# Altium schematic sheet K7410tFFG900Aux.SchDoc
size A3
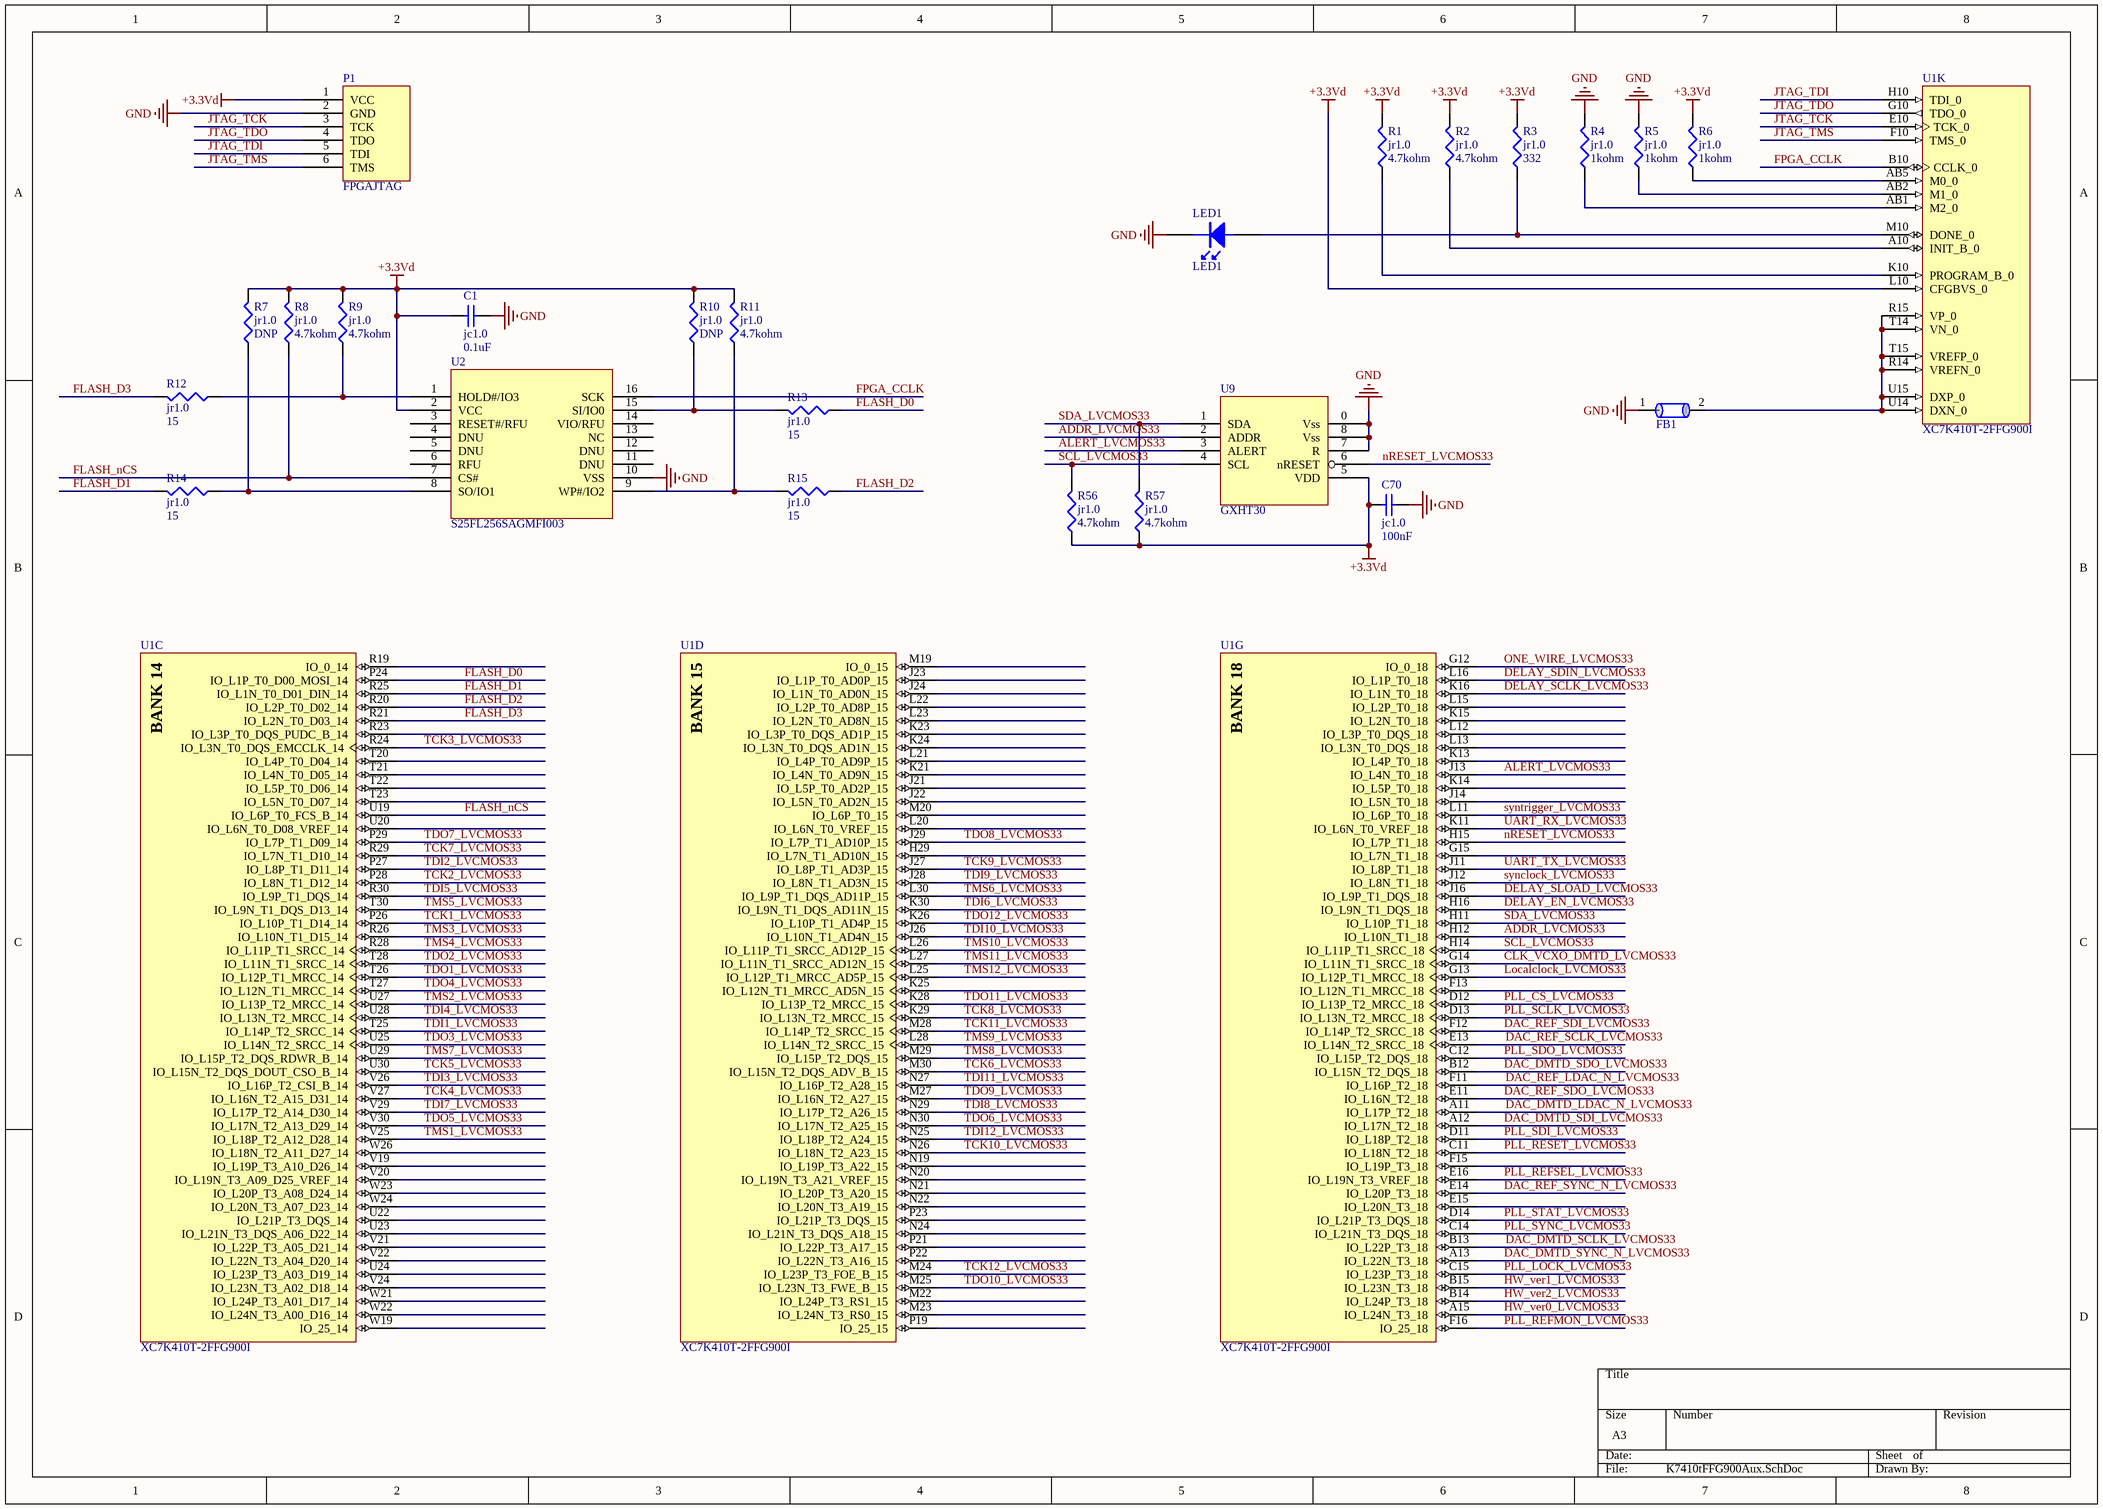
[diagram p0: K7410tFFG900Aux.SchDoc]

## Parts
C1  jc1.0  value 0.1uF  [0402]
C70  jc1.0  value 100nF  [0402]
FB1  Ferrite Bead  [0603]  (value not drawn)
LED1  LED1  [LED1]
P1  FPGAJTAG  [SIP6]
R1  jr1.0  value 4.7kohm  [0402]
R2  jr1.0  value 4.7kohm  [0402]
R3  jr1.0  value 332  [0402]
R4  jr1.0  value 1kohm  [0402]
R5  jr1.0  value 1kohm  [0402]
R6  jr1.0  value 1kohm  [0402]
R7  jr1.0  value DNP  [0402]
R8  jr1.0  value 4.7kohm  [0402]
R9  jr1.0  value 4.7kohm  [0402]
R10  jr1.0  value DNP  [0402]
R11  jr1.0  value 4.7kohm  [0402]
R12  jr1.0  value 15  [0402]
R13  jr1.0  value 15  [0402]
R14  jr1.0  value 15  [0402]
R15  jr1.0  value 15  [0402]
R56  jr1.0  value 4.7kohm  [0402]
R57  jr1.0  value 4.7kohm  [0402]
U1  XC7K410T-2FFG900I  [FFG900]  (parts C,D,G,K of 16)
U2  S25FL256SAGMFI003  [SO3016]
U9  GXHT30  [GXHT30]

## Nets
+3.3Vd: C1.2 C70.1 P1.1(VCC) R1.2 R2.2 R3.2 R6.2 R7.2 R8.2 R9.2 R10.2 R11.2 R56.1 R57.1 U1.L10(CFGBVS_0) U2.2(VCC) U9.5(VDD)
GND: C1.1 C70.2 FB1.1(X) LED1.2 P1.2(GND) R4.2 R5.2 U2.10(VSS) U9.0(Vss) U9.7(R) U9.8(Vss)
ADDR_LVCMOS33: U1.H12(IO_L10N_T1_18) U9.2(ADDR)
ALERT_LVCMOS33: U1.J13(IO_L4N_T0_18) U9.3(ALERT)
CLK_VCXO_DMTD_LVCMOS33: U1.G14(IO_L11N_T1_SRCC_18)
DAC_DMTD_LDAC_N_LVCMOS33: U1.A11(IO_L17P_T2_18)
DAC_DMTD_SCLK_LVCMOS33: U1.B13(IO_L22P_T3_18)
DAC_DMTD_SDI_LVCMOS33: U1.A12(IO_L17N_T2_18)
DAC_DMTD_SDO_LVCMOS33: U1.B12(IO_L15N_T2_DQS_18)
DAC_DMTD_SYNC_N_LVCMOS33: U1.A13(IO_L22N_T3_18)
DAC_REF_LDAC_N_LVCMOS33: U1.F11(IO_L16P_T2_18)
DAC_REF_SCLK_LVCMOS33: U1.E13(IO_L14N_T2_SRCC_18)
DAC_REF_SDI_LVCMOS33: U1.F12(IO_L14P_T2_SRCC_18)
DAC_REF_SDO_LVCMOS33: U1.E11(IO_L16N_T2_18)
DAC_REF_SYNC_N_LVCMOS33: U1.E14(IO_L20P_T3_18)
DELAY_EN_LVCMOS33: U1.H16(IO_L9N_T1_DQS_18)
DELAY_SCLK_LVCMOS33: U1.K16(IO_L1N_T0_18)
DELAY_SDIN_LVCMOS33: U1.L16(IO_L1P_T0_18)
DELAY_SLOAD_LVCMOS33: U1.J16(IO_L9P_T1_DQS_18)
FLASH_D0: R13.1 U1.P24(IO_L1P_T0_D00_MOSI_14)
FLASH_D1: R14.2 U1.R25(IO_L1N_T0_D01_DIN_14)
FLASH_D2: R15.1 U1.R20(IO_L2P_T0_D02_14)
FLASH_D3: R12.2 U1.R21(IO_L2N_T0_D03_14)
FLASH_nCS: R8.1 U1.U19(IO_L6P_T0_FCS_B_14) U2.7(CS#)
FPGA_CCLK: U1.B10(CCLK_0) U2.16(SCK)
HW_ver0_LVCMOS33: U1.A15(IO_L24N_T3_18)
HW_ver1_LVCMOS33: U1.B15(IO_L23N_T3_18)
HW_ver2_LVCMOS33: U1.B14(IO_L24P_T3_18)
JTAG_TCK: P1.3(TCK) U1.E10(TCK_0)
JTAG_TDI: P1.5(TDI) U1.H10(TDI_0)
JTAG_TDO: P1.4(TDO) U1.G10(TDO_0)
JTAG_TMS: P1.6(TMS) U1.F10(TMS_0)
Localclock_LVCMOS33: U1.G13(IO_L12P_T1_MRCC_18)
nRESET_LVCMOS33: U1.H15(IO_L7P_T1_18) U9.6(nRESET)
ONE_WIRE_LVCMOS33: U1.G12(IO_0_18)
PLL_CS_LVCMOS33: U1.D12(IO_L13P_T2_MRCC_18)
PLL_LOCK_LVCMOS33: U1.C15(IO_L23P_T3_18)
PLL_REFMON_LVCMOS33: U1.F16(IO_25_18)
PLL_REFSEL_LVCMOS33: U1.E16(IO_L19N_T3_VREF_18)
PLL_RESET_LVCMOS33: U1.C11(IO_L18N_T2_18)
PLL_SCLK_LVCMOS33: U1.D13(IO_L13N_T2_MRCC_18)
PLL_SDI_LVCMOS33: U1.D11(IO_L18P_T2_18)
PLL_SDO_LVCMOS33: U1.C12(IO_L15P_T2_DQS_18)
PLL_STAT_LVCMOS33: U1.D14(IO_L21P_T3_DQS_18)
PLL_SYNC_LVCMOS33: U1.C14(IO_L21N_T3_DQS_18)
SCL_LVCMOS33: R56.2 U1.H14(IO_L11P_T1_SRCC_18) U9.4(SCL)
SDA_LVCMOS33: R57.2 U1.H11(IO_L10P_T1_18) U9.1(SDA)
synclock_LVCMOS33: U1.J12(IO_L8N_T1_18)
syntrigger_LVCMOS33: U1.L11(IO_L6P_T0_18)
TCK1_LVCMOS33: U1.P26(IO_L10P_T1_D14_14)
TCK2_LVCMOS33: U1.P28(IO_L8N_T1_D12_14)
TCK3_LVCMOS33: U1.R24(IO_L3N_T0_DQS_EMCCLK_14)
TCK4_LVCMOS33: U1.V27(IO_L16N_T2_A15_D31_14)
TCK5_LVCMOS33: U1.U30(IO_L15N_T2_DQS_DOUT_CSO_B_14)
TCK6_LVCMOS33: U1.M30(IO_L15N_T2_DQS_ADV_B_15)
TCK7_LVCMOS33: U1.R29(IO_L7N_T1_D10_14)
TCK8_LVCMOS33: U1.K29(IO_L13N_T2_MRCC_15)
TCK9_LVCMOS33: U1.J27(IO_L8P_T1_AD3P_15)
TCK10_LVCMOS33: U1.N26(IO_L18N_T2_A23_15)
TCK11_LVCMOS33: U1.M28(IO_L14P_T2_SRCC_15)
TCK12_LVCMOS33: U1.M24(IO_L23P_T3_FOE_B_15)
TDI1_LVCMOS33: U1.T25(IO_L14P_T2_SRCC_14)
TDI2_LVCMOS33: U1.P27(IO_L8P_T1_D11_14)
TDI3_LVCMOS33: U1.V26(IO_L16P_T2_CSI_B_14)
TDI4_LVCMOS33: U1.U28(IO_L13N_T2_MRCC_14)
TDI5_LVCMOS33: U1.R30(IO_L9P_T1_DQS_14)
TDI6_LVCMOS33: U1.K30(IO_L9N_T1_DQS_AD11N_15)
TDI7_LVCMOS33: U1.V29(IO_L17P_T2_A14_D30_14)
TDI8_LVCMOS33: U1.N29(IO_L17P_T2_A26_15)
TDI9_LVCMOS33: U1.J28(IO_L8N_T1_AD3N_15)
TDI10_LVCMOS33: U1.J26(IO_L10N_T1_AD4N_15)
TDI11_LVCMOS33: U1.N27(IO_L16P_T2_A28_15)
TDI12_LVCMOS33: U1.N25(IO_L18P_T2_A24_15)
TDO1_LVCMOS33: U1.T26(IO_L12P_T1_MRCC_14)
TDO2_LVCMOS33: U1.T28(IO_L11N_T1_SRCC_14)
TDO3_LVCMOS33: U1.U25(IO_L14N_T2_SRCC_14)
TDO4_LVCMOS33: U1.T27(IO_L12N_T1_MRCC_14)
TDO5_LVCMOS33: U1.V30(IO_L17N_T2_A13_D29_14)
TDO6_LVCMOS33: U1.N30(IO_L17N_T2_A25_15)
TDO7_LVCMOS33: U1.P29(IO_L7P_T1_D09_14)
TDO8_LVCMOS33: U1.J29(IO_L7P_T1_AD10P_15)
TDO9_LVCMOS33: U1.M27(IO_L16N_T2_A27_15)
TDO10_LVCMOS33: U1.M25(IO_L23N_T3_FWE_B_15)
TDO11_LVCMOS33: U1.K28(IO_L13P_T2_MRCC_15)
TDO12_LVCMOS33: U1.K26(IO_L10P_T1_AD4P_15)
TMS1_LVCMOS33: U1.V25(IO_L18P_T2_A12_D28_14)
TMS2_LVCMOS33: U1.U27(IO_L13P_T2_MRCC_14)
TMS3_LVCMOS33: U1.R26(IO_L10N_T1_D15_14)
TMS4_LVCMOS33: U1.R28(IO_L11P_T1_SRCC_14)
TMS5_LVCMOS33: U1.T30(IO_L9N_T1_DQS_D13_14)
TMS6_LVCMOS33: U1.L30(IO_L9P_T1_DQS_AD11P_15)
TMS7_LVCMOS33: U1.U29(IO_L15P_T2_DQS_RDWR_B_14)
TMS8_LVCMOS33: U1.M29(IO_L15P_T2_DQS_15)
TMS9_LVCMOS33: U1.L28(IO_L14N_T2_SRCC_15)
TMS10_LVCMOS33: U1.L26(IO_L11P_T1_SRCC_AD12P_15)
TMS11_LVCMOS33: U1.L27(IO_L11N_T1_SRCC_AD12N_15)
TMS12_LVCMOS33: U1.L25(IO_L12P_T1_MRCC_AD5P_15)
UART_RX_LVCMOS33: U1.K11(IO_L6N_T0_VREF_18)
UART_TX_LVCMOS33: U1.J11(IO_L8P_T1_18)
NetFB1_2: FB1.2(Y) U1.R14(VREFN_0) U1.R15(VP_0) U1.T14(VN_0) U1.T15(VREFP_0) U1.U14(DXN_0) U1.U15(DXP_0)
NetLED1_1: LED1.1 R3.1 U1.M10(DONE_0)
NetR1_1: R1.1 U1.K10(PROGRAM_B_0)
NetR2_1: R2.1 U1.A10(INIT_B_0)
NetR4_1: R4.1 U1.AB1(M2_0)
NetR5_1: R5.1 U1.AB2(M1_0)
NetR6_1: R6.1 U1.AB5(M0_0)
NetR7_1: R7.1 R14.1 U2.8(SO/IO1)
NetR9_1: R9.1 R12.1 U2.1(HOLD#/IO3)
NetR10_1: R10.1 R13.2 U2.15(SI/IO0)
NetR11_1: R11.1 R15.2 U2.9(WP#/IO2)

Not connected (* = marked no-connect by the designer): U1 E15(IO_L20N_T3_18) F13(IO_L12N_T1_MRCC_18) F15(IO_L19P_T3_18) G15(IO_L7N_T1_18) H29(IO_L7N_T1_AD10N_15) J14(IO_L5N_T0_18) J21(IO_L5P_T0_AD2P_15) J22(IO_L5N_T0_AD2N_15) J23(IO_L1P_T0_AD0P_15) J24(IO_L1N_T0_AD0N_15) K13(IO_L4P_T0_18) K14(IO_L5P_T0_18) K15(IO_L2N_T0_18) K21(IO_L4N_T0_AD9N_15) K23(IO_L3P_T0_DQS_AD1P_15) K24(IO_L3N_T0_DQS_AD1N_15) K25(IO_L12N_T1_MRCC_AD5N_15) L12(IO_L3P_T0_DQS_18) L13(IO_L3N_T0_DQS_18) L15(IO_L2P_T0_18) L20(IO_L6N_T0_VREF_15) L21(IO_L4P_T0_AD9P_15) L22(IO_L2P_T0_AD8P_15) L23(IO_L2N_T0_AD8N_15) M19(IO_0_15) M20(IO_L6P_T0_15) M22(IO_L24P_T3_RS1_15) M23(IO_L24N_T3_RS0_15) N19(IO_L19P_T3_A22_15) N20(IO_L19N_T3_A21_VREF_15) N21(IO_L20P_T3_A20_15) N22(IO_L20N_T3_A19_15) N24(IO_L21N_T3_DQS_A18_15) P19(IO_25_15) P21(IO_L22P_T3_A17_15) P22(IO_L22N_T3_A16_15) P23(IO_L21P_T3_DQS_15) R19(IO_0_14) R23(IO_L3P_T0_DQS_PUDC_B_14) T20(IO_L4P_T0_D04_14) T21(IO_L4N_T0_D05_14) T22(IO_L5P_T0_D06_14) T23(IO_L5N_T0_D07_14) U20(IO_L6N_T0_D08_VREF_14) U22(IO_L21P_T3_DQS_14) U23(IO_L21N_T3_DQS_A06_D22_14) U24(IO_L23P_T3_A03_D19_14) V19(IO_L19P_T3_A10_D26_14) V20(IO_L19N_T3_A09_D25_VREF_14) V21(IO_L22P_T3_A05_D21_14) V22(IO_L22N_T3_A04_D20_14) V24(IO_L23N_T3_A02_D18_14) W19(IO_25_14) W21(IO_L24P_T3_A01_D17_14) W22(IO_L24N_T3_A00_D16_14) W23(IO_L20P_T3_A08_D24_14) W24(IO_L20N_T3_A07_D23_14) W26(IO_L18N_T2_A11_D27_14); U2 3(RESET#/RFU) 4(DNU) 5(DNU) 6(RFU) 11(DNU) 12(DNU) 13(NC) 14(VIO/RFU)

## Notes on the sheet
- (in symbol XC7K410T-2FFG900I, part C) BANK 14
- (in symbol XC7K410T-2FFG900I, part D) BANK 15
- (in symbol XC7K410T-2FFG900I, part G) BANK 18

## Library data of the parts
C1 C70 = Cap: Capacitor; Published: 8-Jun-2000; LatestRevisionDate: 17-Jul-2002; LatestRevisionNote: Re-released for DXP Platform.; PackageReference: RAD-0.3; Publisher: Altium Limited
FB1 = FerriteBead
P1 = FPGAJTAGHEADER
R1-R15 R56 R57 = Res: Resistor; Published: 8-Jun-2000; LatestRevisionDate: 04-Mar-2005; LatestRevisionNote: PCB Footprint replaced.; PackageReference: J1-0603; Publisher: Altium Limited
U1 = XC7K410T-2FFG900I: Kintex-7 FPGA, 500 User I/Os, 16 GTX, 900-Ball BGA, Speed Grade 2, Industrial Grade, Pb-Free; Manufacturer: Xilinx; GTX: 16; SelectIO HP: 150; SelectIO HR: 350; Speed Grade: -2; DatasheetVersion: v1.12; PackageVersion: Rev 1.1; PackageReference: FFG900; PackageDescription: Flip-Chip BGA, Body 31 x 31 mm, 1.0 mm Pitch; Generic Part Number: XC7K410T; RoHS: Pb-Free; Mounting Technology: Surface Mount; Code_JEDEC: MS-034-AAN-1; PartNumber: XC7K410T-2FFG900I; ComponentLink1Description: Datasheet; ComponentLink1URL: http://www.xilinx.com/support/documentation/data_sheets/ds180_7Series_Overview.pdf; ComponentLink2Description: Package Specification; ComponentLink2URL: http://www.xilinx.com/support/documentation/user_guides/ug865-Zynq-7000-Pkg-Pinout.pdf